# Altium schematic sheet connectors-internal.SchDoc
size A3; DocumentNumber: 13; SheetNumber: 13; SheetTotal: 45; SheetDescription: Connectors (internal)
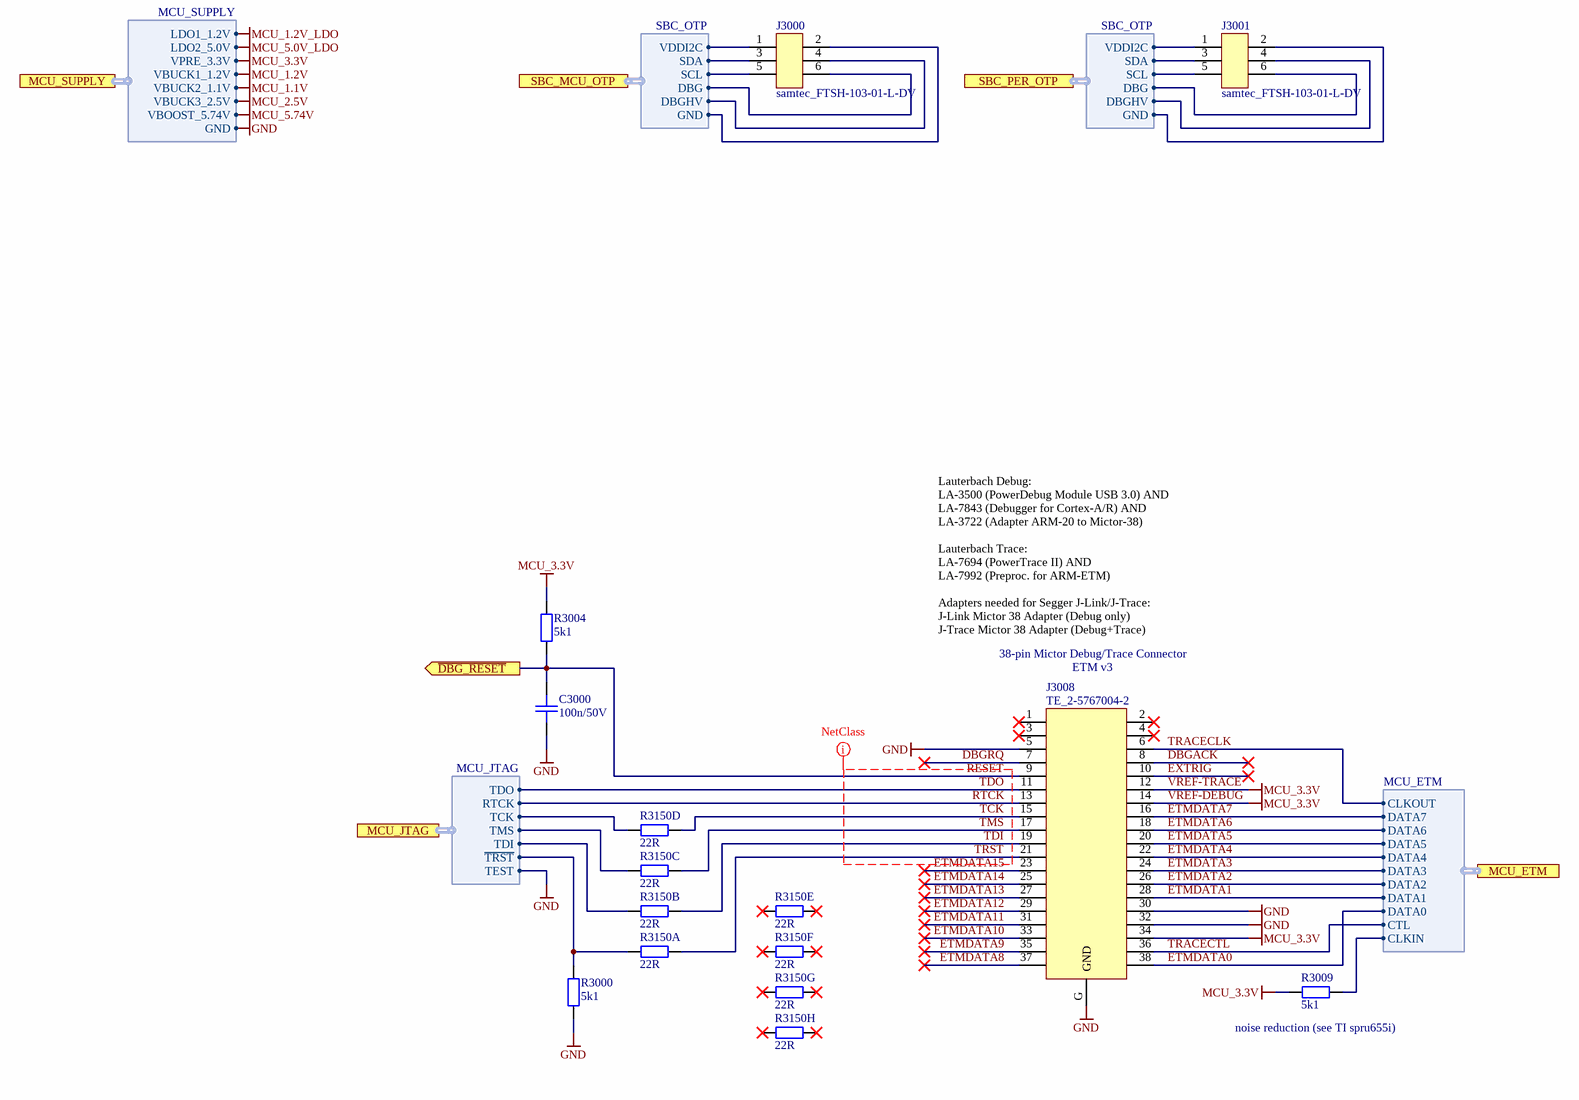
[diagram p0: connectors-internal.SchDoc]

## Parts
C3000  100n/50V  [CAPC1005X06N]
J3000  samtec_FTSH-103-01-L-DV  [SAMTEC_FTSH-103-01-L-DV]
J3001  samtec_FTSH-103-01-L-DV  [SAMTEC_FTSH-103-01-L-DV]
J3008  TE_2-5767004-2  [TE_2-5767004-2]
R3000  5k1  [RESC1005X04N]
R3004  5k1  [RESC1005X04N]
R3009  5k1  [RESC1005X04N]
R3150  22R  [PANASONIC_EXB2HV]  (parts A,B,C,D,E,F,G,H of 8)

## Ports
MCU_ETM (harness MCU_ETM), MCU_JTAG (harness MCU_JTAG), MCU_SUPPLY (harness MCU_SUPPLY), SBC_MCU_OTP (harness SBC_OTP), SBC_PER_OTP (harness SBC_OTP), ~{DBG_RESET} (out)

## Harnesses
SBC_OTP: VDDI2C, SDA, SCL, GND, DBG, DBGHV
MCU_SUPPLY: VBUCK1_1.2V, VBUCK2_1.1V, VBUCK3_2.5V, LDO1_1.2V, LDO2_5.0V, GND, VPRE_3.3V, VBOOST_5.74V
MCU_ETM: CLKOUT, CTL, CLKIN, DATA0, DATA1, DATA2, DATA3, DATA4, DATA5, DATA6, DATA7
MCU_JTAG: ~{TRST}, RTCK, TCK, TDI, TDO, TMS, TEST

## Nets
GND: C3000.1 J3008.5 J3008.30 J3008.32 J3008.G(GND) R3000.1 ; port MCU_SUPPLY.GND, port MCU_JTAG.TEST
MCU_1.1V: port MCU_SUPPLY.VBUCK2_1.1V
MCU_1.2V: port MCU_SUPPLY.VBUCK1_1.2V
MCU_1.2V_LDO: port MCU_SUPPLY.LDO1_1.2V
MCU_2.5V: port MCU_SUPPLY.VBUCK3_2.5V
MCU_5.0V_LDO: port MCU_SUPPLY.LDO2_5.0V
MCU_5.74V: port MCU_SUPPLY.VBOOST_5.74V
VREF-DEBUG: J3008.12 J3008.14 J3008.34 R3004.2 R3009.2 ; port MCU_SUPPLY.VPRE_3.3V  [also labelled MCU_3.3V, VREF-TRACE]
~{RESET}: C3000.2 J3008.9 R3004.1 ; port ~{DBG_RESET}
~{TRST}: J3008.21 R3150.16
DBGACK: J3008.8
DBGRQ: J3008.7
ETMDATA0: J3008.38 ; port MCU_ETM.DATA0
ETMDATA1: J3008.28 ; port MCU_ETM.DATA1
ETMDATA2: J3008.26 ; port MCU_ETM.DATA2
ETMDATA3: J3008.24 ; port MCU_ETM.DATA3
ETMDATA4: J3008.22 ; port MCU_ETM.DATA4
ETMDATA5: J3008.20 ; port MCU_ETM.DATA5
ETMDATA6: J3008.18 ; port MCU_ETM.DATA6
ETMDATA7: J3008.16 ; port MCU_ETM.DATA7
ETMDATA8: J3008.37
ETMDATA9: J3008.35
ETMDATA10: J3008.33
ETMDATA11: J3008.31
ETMDATA12: J3008.29
ETMDATA13: J3008.27
ETMDATA14: J3008.25
ETMDATA15: J3008.23
EXTRIG: J3008.10
RTCK: J3008.13 ; port MCU_JTAG.RTCK
TCK: J3008.15 R3150.13
TDI: J3008.19 R3150.15
TDO: J3008.11 ; port MCU_JTAG.TDO
TMS: J3008.17 R3150.14
TRACECLK: J3008.6 ; port MCU_ETM.CLKOUT
TRACECTL: J3008.36 ; port MCU_ETM.CTL
NetJ3000_1: J3000.1 ; port SBC_MCU_OTP.VDDI2C
NetJ3000_2: J3000.2 ; port SBC_MCU_OTP.GND
NetJ3000_3: J3000.3 ; port SBC_MCU_OTP.SDA
NetJ3000_4: J3000.4 ; port SBC_MCU_OTP.DBGHV
NetJ3000_5: J3000.5 ; port SBC_MCU_OTP.SCL
NetJ3000_6: J3000.6 ; port SBC_MCU_OTP.DBG
NetJ3001_1: J3001.1 ; port SBC_PER_OTP.VDDI2C
NetJ3001_2: J3001.2 ; port SBC_PER_OTP.GND
NetJ3001_3: J3001.3 ; port SBC_PER_OTP.SDA
NetJ3001_4: J3001.4 ; port SBC_PER_OTP.DBGHV
NetJ3001_5: J3001.5 ; port SBC_PER_OTP.SCL
NetJ3001_6: J3001.6 ; port SBC_PER_OTP.DBG
NetR3000_2: R3000.2 R3150.1 ; port MCU_JTAG.~{TRST}
NetR3009_1: R3009.1 ; port MCU_ETM.CLKIN
NetR3150_2: R3150.2 ; port MCU_JTAG.TDI
NetR3150_3: R3150.3 ; port MCU_JTAG.TMS
NetR3150_4: R3150.4 ; port MCU_JTAG.TCK

Not connected (* = marked no-connect by the designer): J3008 1* 2* 3* 4*; R3150 5* 6* 7* 8* 9* 10* 11* 12*

## Layout directives
net class MCU_JTAG: RTCK, TCK, TDI, TDO, TMS, ~{RESET}, ~{TRST}

## Notes on the sheet
- Lauterbach Debug:
  LA-3500 (PowerDebug Module USB 3.0) AND
  LA-7843 (Debugger for Cortex-A/R) AND
  LA-3722	(Adapter ARM-20 to Mictor-38)
  Lauterbach Trace:
  LA-7694 (PowerTrace II) AND
  LA-7992 (Preproc. for ARM-ETM)
  Adapters needed for Segger J-Link/J-Trace:
  J-Link Mictor 38 Adapter (Debug only)
  J-Trace Mictor 38 Adapter (Debug+Trace)
- 38-pin Mictor Debug/Trace Connector
- (near J3008) ETM v3
- (near R3009) noise reduction (see TI spru655i)
- Fraunhofer IISB
- Schottkystr. 10
- developed by:
- 91058 Erlangen
- Germany
- Author
- Project
- License
- Description
- File
- Version
- Release Date
- Sheet
- foxbms.org <https://foxbms.org>
- www.iisb.fraunhofer.de <https://www.iisb.fraunhofer.de/>
- foxBMS Team
- /

## Library data of the parts
C3000 = gen_C_ceramic_100n_50V_X7R_0402: MLCC; Capacitance: 100n; Rated Voltage: 50V; Dielectric: X7R; Case EIA: 0402; Case Metric: 1005; PnP Package: 0402C; PnP Value: 100nF/50V/X7R; PnP equipped: x; Automotive Qualified: True; AEC-Q Norm: AEC-Q200; Part Number: gen_C_ceramic_100n_50V_X7R_0402; Supplier 1: Farnell; Supplier Part Number 1: 2210822; ECCN: EAR99
J3000 J3001 = samtec_FTSH-103-01-L-DV: Board-To-Board Connector, 6pin, 1.27mm; Manufacturer: Samtec; Circuits: 6; Rated Current: 3.4A; Automotive Qualified: False; Part Number: samtec_FTSH-103-01-L-DV; Part Name: FTSH-103-01-L-DV; Operating Temperature: -55°C - +125°C; ComponentLink1Description: Datasheet; ComponentLink1URL: http://www.farnell.com/datasheets/1992056.pdf; Supplier 1: Farnell; Supplier Part Number 1: 2415840; Supplier 2: Mouser; Supplier Part Number 2: 200-FTSH10301LDVTR; Supplier 3: Digikey; Supplier Part Number 3: SAM13920CT-ND
J3008 = TE_2-5767004-2: Connector, SMT, 38 POS, MICTOR; Manufacturer: TE; Circuits: 38; Rated Voltage: 30V AC; Rated Current: 11.5A; Automotive Qualified: False; Part Number: TE_2-5767004-2; Part Name: TE_2-5767004-2; Operating Temperature: −55 °C - +125 °C; ComponentLink1Description: Datasheet; ComponentLink1URL: https://www.te.com/deu-de/product-2-5767004-2.datasheet.pdf; Supplier 1: Mouser; Supplier Part Number 1: 571-2-5767004-2; Supplier 2: Farnell; Supplier Part Number 2: 1076633; Supplier 3: Digikey; Supplier Part Number 3: A32308-ND; ECCN: EAR99
R3000 R3004 R3009 = gen_R_5k1_0402: SMD Resistor 5k1 0402; Tolerance: 1%; Power: 0.063W; Case EIA: 0402; Case Metric: 1005; Maximum Working Voltage: 50V; PnP Package: 0402R; Automotive Qualified: True; PnP equipped: x; AEC-Q Norm: AEC-Q200; AEC-Q Grade: Grade 0; Part Number: gen_R_5k1_0402; Operating Temperature: -55°C - +155°C; Resistance: 5k1; Series: E24; PnP Value: 5k1; Supplier 1: Farnell; Supplier Part Number 1: 2302709; ECCN: EAR99
R3150 = EXB2HV220JV: SMD Resistor Array 0402 8x; Tolerance: 5%; Power: 63mW; Case EIA: EXB2HV; Maximum Working Voltage: 25V; Automotive Qualified: True; AEC-Q Norm: AEC-Q200; AEC-Q Grade: Grade 1; Part Number: EXB2HV220JV; Operating Temperature: -55°C - +155°C; Resistance: 22R; Series: E24, E96; Supplier 1: Farnell; Supplier Part Number 1: 2060065; Supplier 2: Mouser; Supplier Part Number 2: 667-EXB-2HV220JV; ECCN: EAR99